# EAGLE design Elecrow SIMduino v2.2 (EAGLE 6.1)
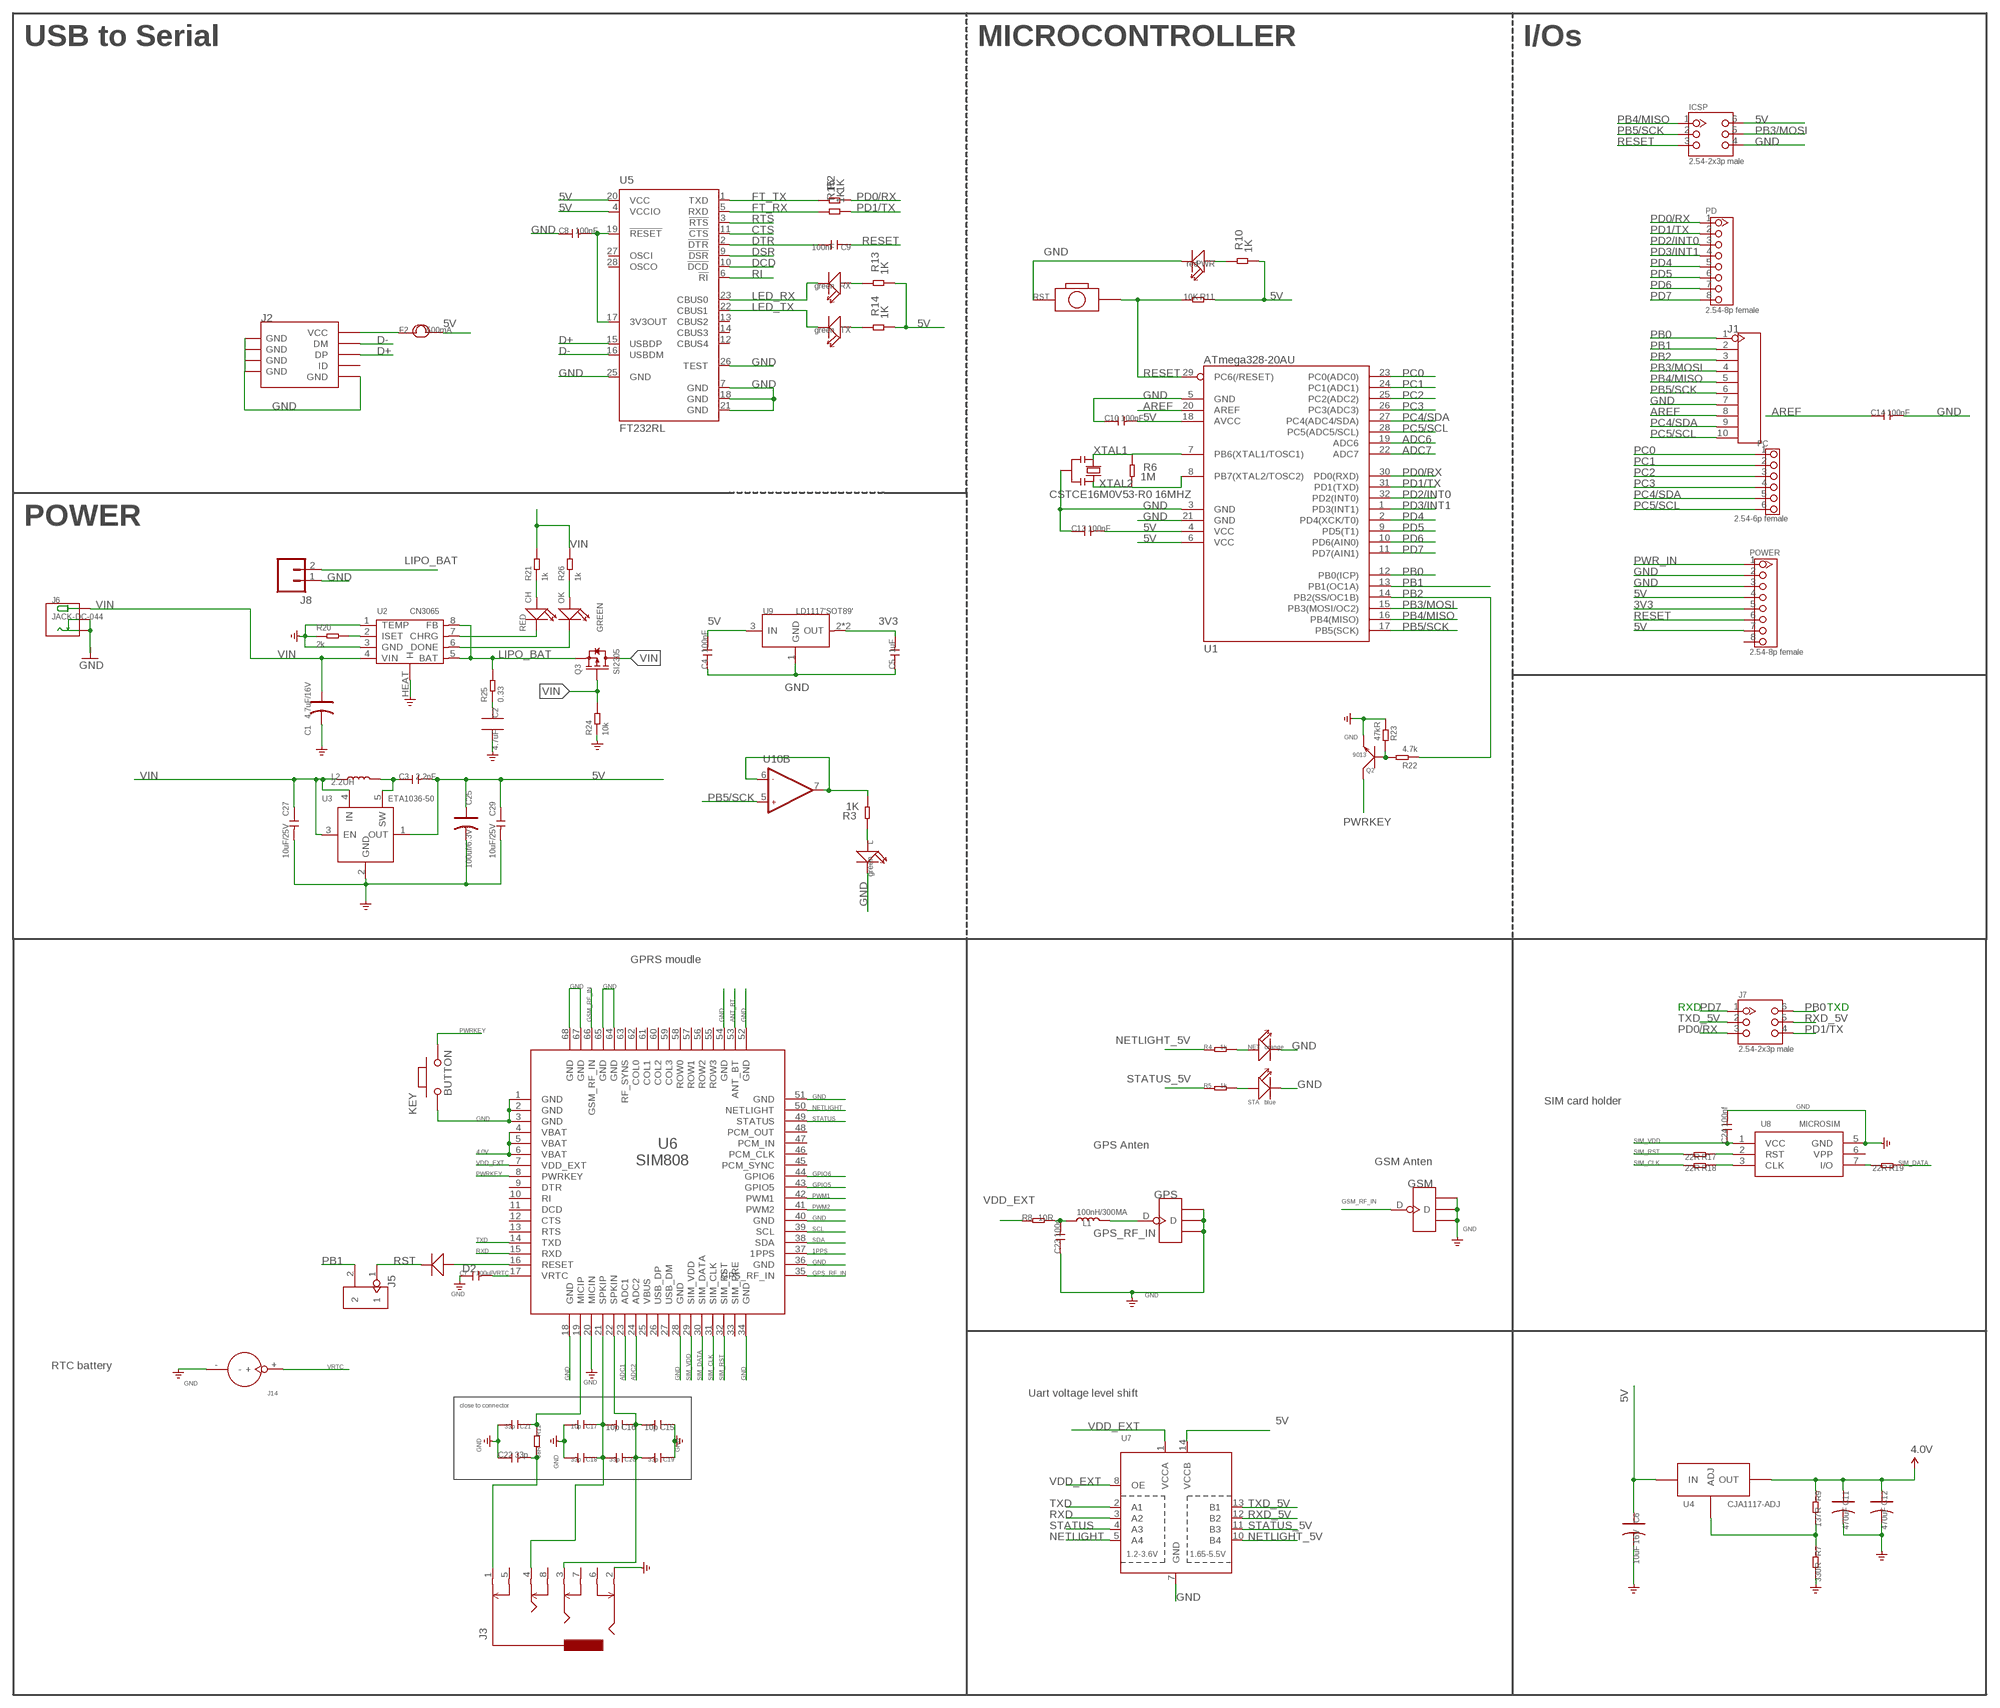
[diagram p0: schematic, sheet 1]

## Parts
C1  4.7uF/16V  006-CAP_AVX_A  [AVX_A]
C2  4.7uF  C0805  [0805]
C3  2.2nF  C-0603  [C0603]
C4  100nF  C-0603  [C0603]
C5  1uF  C-0603  [C0603]
C6  10uF 16V  CAP-AVX-A  [AVX-A]
C7  100uF  C-0805  [C0805]
C8  100nF  C-0603  [C0603]
C9  100nF  C-0603  [C0603]
C10  100nF  C-0603  [C0603]
C11  470uF  CAP-AVX-D  [AVX-D]
C12  470uF  CAP-AVX-D  [AVX-D]
C13  100nF  C-0603  [C0603]
C14  100nF  C-0603  [C0603]
C15  10p  C-0402  [C0402]
C16  10p  C-0402  [C0402]
C17  10p  C-0402  [C0402]
C18  33p  C-0402  [C0402]
C19  33p  C-0402  [C0402]
C20  33p  C-0402  [C0402]
C21  33p  C-0603  [C0603]
C22  33p  C-0603  [C0603]
C23  100n  C-0603  [C0603]
C24  100nf  C-0603  [C0603]
C25  100uf/6.3V  CAP-AVX-B  [AVX-B]
C27  10uF/25V  CAP-0805  [C0805]
C29  10uF/25V  CAP-0805  [C0805]
CH  RED  LED'0603'  [LED-0603]
D2  D'0805'  [SOD323]
F2  500mA  FUSE1206  [R1206@1]
GPS  ANTENNA-U-FL  [4P-U-FL]
GSM  ANTENNA-U-FL  [4P-U-FL]
ICSP  2.54-2x3p male  HEADER-2X3P-2.54  [2X3P-2.54]
J1  HEADER-10P-2.54  [10P-2.54]
J2  USB-MINIUSB-5P-STRONG  [MINI-SMD-5P]
J3  AUDIO-8P'PJ-3536-L6S'  [8P-3.5-SMD]
J5  HEADER-2P-65/35MIL  [2P-2.54-65/35MIL]
J6  JACK-DC-044  [DC-404]
J7  2.54-2x3p male  HEADER-2X3P-2.54  [2X3P-2.54]
J8  M02-JST-2MM-SMT  [JST-2-SMD]
J14  HOLDER-BATTERY-2P-CR1220  [CR1220]
KEY  BUTTON  PB157  [157SW]
L  green  LED'0603'  [LED-0603]
L1  100nH/300MA  L'0603'  [L0603]
L2  2.2UH  CD32'4R7'  [SD32-4R7MC]
NET  orange  LED'0603'  [LED-0603]
OK  GREEN  LED'0603'  [LED-0603]
PC  2.54-6p female  HEADER-6P-65/35MIL  [6P-2.54-65/35MIL]
PD  2.54-8p female  HEADER-8P-2.54  [8P-2.54]
POWER  2.54-8p female  HEADER-8P-2.54  [8P-2.54]
PWR  red  LED'0603'  [LED-0603]
Q2  9013  TRANSISTOR-NPN-SOT23  [SOT23]
Q3  SI2305  MOSFET-P'SI2323CDS/SI2305DS<BR>'  [SOT-23]
R2  1K  R-0603  [R0603]
R3  1K  R-0603  [R0603]
R4  1k  R-0603  [R0603]
R5  1k  R-0603  [R0603]
R6  1M  R-0603  [R0603]
R7  330R  R-0603  [R0603]
R8  10R  R-0603  [R0603]
R9  137R  R-0603  [R0603]
R10  1K  R-0603  [R0603]
R11  10K  R-0603  [R0603]
R12  68R  R-0603  [R0603]
R13  1K  R-0603  [R0603]
R14  1K  R-0603  [R0603]
R15  1K  R-0603  [R0603]
R17  22R  R-0603  [R0603]
R18  22R  R-0603  [R0603]
R19  22R  R-0603  [R0603]
R20  2k  RES-0603  [R0603]
R21  1k  RES-0603  [R0603]
R22  4.7k  R-0402  [R0402]
R23  47kR  R-0402  [R0402]
R24  10k  RES-0603  [R0603]
R25  0.33  RES-0603  [R0603]
R26  1k  RES-0603  [R0603]
RST  BOTTON-2P-90D  [2P-7.62X3.56-90D]
RX  green  LED'0603'  [LED-0603]
STA  blue  LED'0603'  [LED-0603]
TX  green  LED'0603'  [LED-0603]
U1  ATmega328-20AU  ATMEGA168  [TQFP32]
U2  CN3065  PMIC-CN3065-DFN8  [DFN-8]
U3  ETA1036-50  ETA1036  [SOT23-5]
U4  CJA1117-ADJ  [SOT89]
U5  FT232RL  [SSOP28]
U6  SIM808  [SIM808]
U7  TXB0104PWR  [TSSOP14]
U8  MICROSIM  [MICROSIM]
U9  LD1117'SOT89'  [SOT89]
U10  LMV358DGK  [MSOP8]
Y2  CSTCE16M0V53-R0 16MHZ  RESONATORMU  [RESONATOR]

## Nets
1PPS: U6.37(1PPS)
3V3: C5.2 POWER.5 U9.2(OUT) U9.4(OUT)
4.0V: C11.+ C12.+ R9.1 U4.2(OUT) U4.4(OUT) U6.4(VBAT) U6.5(VBAT) U6.6(VBAT)
5V [usbvcc]: C3.2 C4.2 C6.+ C10.2 C13.2 C25.+ C29.1 F2.2 ICSP.6 POWER.4 POWER.7 R10.1 R11.1 R13.1 R14.1 U1.4(VCC) U1.6(VCC) U1.18(AVCC) U3.1(OUT) U4.3(IN) U5.4(VCCIO) U5.20(VCC) U7.14(VCCB) U9.3(IN)
ADC1: U6.23(ADC1)
ADC2: U6.24(ADC2)
ADC6: U1.19(ADC6)
ADC7: U1.22(ADC7)
ANT_BT: U6.53(ANT_BT)
AREF: C14.1 J1.8 U1.20(AREF)
CTS: U5.11(!CTS)
D+: J2.3(DP) U5.15(USBDP)
D-: J2.2(DM) U5.16(USBDM)
DCD: U5.10(!DCD)
DSR: U5.9(!DSR)
DTR: C9.2 U5.2(!DTR)
FT_RX: R15.2 U5.5(RXD)
FT_TX: R2.2 U5.1(TXD)
GND: C1.- C2.2 C4.1 C5.1 C6.- C7.1 C8.1 C10.1 C11.- C12.- C13.1 C14.2 C15.1 C17.2 C18.2 C19.1 C21.2 C22.1 C23.1 C24.2 C25.- C27.2 C29.2 GPS.GND1 GPS.GND2 GPS.GND3 GSM.GND1 GSM.GND2 GSM.GND3 ICSP.4 J1.7 J2.5(GND) J2.GND@1(GND) J2.GND@2(GND) J2.GND@3(GND) J2.GND@4(GND) J3.2 J6.- J6.CDN J8.1 J14.- KEY.1 L.- NET.- POWER.2 POWER.3 PWR.- Q2.2(E) R7.2 R20.1 R23.1 R24.1 RST.P$1 STA.- U1.3(GND) U1.5(GND) U1.21(GND) U2.1(TEMP) U2.3(GND) U2.HEAT(H) U3.2(GND) U5.7(GND) U5.18(GND) U5.21(GND) U5.25(GND) U5.26(TEST) U6.1(GND) U6.2(GND) U6.3(GND) U6.18(GND) U6.20(MICIN) U6.28(GND) U6.34(GND) U6.36(GND) U6.40(GND) U6.51(GND) U6.52(GND) U6.54(GND) U6.64(GND) U6.65(GND) U6.67(GND) U6.68(GND) U7.7(GND) U8.5(GND) U9.1(GND) Y2.2
GPIO5: U6.43(GPIO5)
GPIO6: U6.44(GPIO6)
GPS_RF_IN: GPS.D L1.2 U6.35(GPS_RF_IN)
GSM_RF_IN: GSM.D U6.66(GSM_RF_IN)
LED_RX: RX.- U5.23(CBUS0)
LED_TX: TX.- U5.22(CBUS1)
LIPO_BAT: J8.2 Q3.2(S) R25.2 U2.5(BAT) U2.8(FB)
N$1: R20.2 U2.2(ISET)
N$2: R13.2 RX.+
N$3: L.+ R3.2
N$4: R5.2 STA.+
N$5: R3.1 U10.6(B:-IN2) U10.7(B:OUT2)
N$6: C8.2 U5.17(3V3OUT) U5.19(!RESET)
N$7: PWR.+ R10.2
N$8: R14.2 TX.+
N$9: F2.1 J2.1(VCC)
N$10: NET.+ R4.2
N$11: R18.1 U8.3(CLK)
N$12: R17.1 U8.2(RST)
N$13: C21.1 R12.1 U6.19(MICIP)
N$15: C16.2 C17.1 C18.1 C20.2 J3.4 U6.21(SPKIP)
N$16: R19.2 U8.7(I/O)
N$17: R7.1 R9.2 U4.1(ADJ)
N$18: D2.+ U6.16(RESET)
N$19: C15.2 C16.1 C19.2 C20.1 J3.3 U6.22(SPKIN)
N$20: CH.- U2.7(CHRG)
N$21: C23.2 L1.1 R8.2
N$22: OK.- U2.6(DONE)
N$23: OK.+ R26.1
N$24: C2.1 R25.1
N$25: CH.+ R21.1
N$27: C3.1 L2.2 U3.5(SW)
N$30: C22.2 J3.1 R12.2
N$68: Q2.1(B) R22.2 R23.2
NETLIGHT: U6.50(NETLIGHT) U7.5(A4)
NETLIGHT_5V: R4.1 U7.10(B4)
PB0: J1.1 J7.6 U1.12(PB0(ICP))
PB1: J1.2 J5.2 U1.13(PB1(OC1A))
PB2: J1.3 R22.1 U1.14(PB2(SS/OC1B))
PB3/MOSI: ICSP.5 J1.4 U1.15(PB3(MOSI/OC2))
PB4/MISO: ICSP.1 J1.5 U1.16(PB4(MISO))
PB5/SCK: ICSP.2 J1.6 U1.17(PB5(SCK)) U10.5(B:+IN2)
PC0: PC.1 U1.23(PC0(ADC0))
PC1: PC.2 U1.24(PC1(ADC1))
PC2: PC.3 U1.25(PC2(ADC2))
PC3: PC.4 U1.26(PC3(ADC3))
PC4/SDA: J1.9 PC.5 U1.27(PC4(ADC4/SDA))
PC5/SCL: J1.10 PC.6 U1.28(PC5(ADC5/SCL))
PD0/RX: J7.3 PD.1 R2.1 U1.30(PD0(RXD))
PD1/TX: J7.4 PD.2 R15.1 U1.31(PD1(TXD))
PD2/INT0: PD.3 U1.32(PD2(INT0))
PD3/INT1: PD.4 U1.1(PD3(INT1))
PD4: PD.5 U1.2(PD4(XCK/T0))
PD5: PD.6 U1.9(PD5(T1))
PD6: PD.7 U1.10(PD6(AIN0))
PD7: J7.1 PD.8 U1.11(PD7(AIN1))
PWM1: U6.42(PWM1)
PWM2: U6.41(PWM2)
PWR_IN: POWER.1
PWRKEY: KEY.2 Q2.3(C) U6.8(PWRKEY)
RESET: C9.1 ICSP.3 POWER.6 R11.2 RST.P$2 U1.29(PC6(/RESET))
RI: U5.6(!RI)
RST: D2.- J5.1
RTS: U5.3(!RTS)
RXD: U6.15(RXD) U7.3(A2)
RXD_5V: J7.5 U7.12(B2)
SCL: U6.39(SCL)
SDA: U6.38(SDA)
SIM_CLK: R18.2 U6.31(SIM_CLK)
SIM_DATA: R19.1 U6.30(SIM_DATA)
SIM_RST: R17.2 U6.32(SIM_RST)
SIM_VDD: C24.1 U6.29(SIM_VDD) U8.1(VCC)
STATUS: U6.49(STATUS) U7.4(A3)
STATUS_5V: R5.1 U7.11(B3)
TXD: U6.14(TXD) U7.2(A1)
TXD_5V: J7.2 U7.13(B1)
VDD_EXT: R8.1 U6.7(VDD_EXT) U7.1(VCCA) U7.8(OE)
VIN: C1.+ C27.1 J6.+ L2.1 Q3.1(G) Q3.3(D) R21.2 R24.2 R26.2 U2.4(VIN) U3.3(EN) U3.4(IN)
VRTC: C7.2 J14.+ U6.17(VRTC)
XTAL1: R6.2 U1.7(PB6(XTAL1/TOSC1)) Y2.1
XTAL2: R6.1 U1.8(PB7(XTAL2/TOSC2)) Y2.3
Unconnected: J2.4(ID) J3.5 J3.6 J3.7 J3.8 POWER.8 U5.12(CBUS4) U5.13(CBUS2) U5.14(CBUS3) U5.27(OSCI) U5.28(OSCO) U6.9(DTR) U6.10(RI) U6.11(DCD) U6.12(CTS) U6.13(RTS) U6.25(VBUS) U6.26(USB_DP) U6.27(USB_DM) U6.33(SIM_PRE) U6.45(PCM_SYNC) U6.46(PCM_CLK) U6.47(PCM_IN) U6.48(PCM_OUT) U8.6(VPP) U10.1(A:OUT1) U10.2(A:-IN1) U10.3(A:+IN1)

## Notes on the sheet
- USB to Serial | MICROCONTROLLER | I/Os
- POWER
- GPRS moudle
- RXD | TXD
- SIM card holder
- GPS Anten
- GSM Anten
- RTC battery
- Uart voltage level shift
- close to connector

## Power pins joined to a net without a drawn wire
+V: U10.8(A:+V)
COL0: U6.62(COL0)
COL1: U6.61(COL1)
COL2: U6.60(COL2)
COL3: U6.59(COL3)
GND: U10.4(A:GND)
RF_SYNS: U6.63(RF_SYNS)
ROW0: U6.58(ROW0)
ROW1: U6.57(ROW1)
ROW2: U6.56(ROW2)
ROW3: U6.55(ROW3)

## Library data of the parts
C1 = Discrete:006-CAP*: Electrolytic Capacitors,Tantalum Capacitors and Super Capacitors
C2 = CPT_SMD:C0805
C3-C5 C7-C10 C13-C24 = Discrete:C*: Ceramic Capacitors
C6 C11 C12 = Common:CAP*
C25 = Discrete:CAP*: Electrolytic Capacitors,Tantalum Capacitors and Super Capacitors
C27 C29 = Discrete-new:CAP: Ceramic Capacitors
CH OK = Discrete-new:LED
D2 = Discrete:D*
F2 = Discrete:FUSE
GPS GSM = Connector:ANTENNA-U-FL
ICSP J7 = Connector:HEADER-2X3P
J1 = Connector:HEADER-10P
J2 = Connector:USB-MINIUSB-5P
J3 = template:AUDIO-8P
J5 = Connector:HEADER-2P
J6 = Connector:JACK-DC-044
J8 = SparkFun:M02: Header 2 Standard 2-pin 0.1" header. Use with straight break away headers (SKU : PRT-00116), right angle break away headers (PRT-00553), swiss pins (PRT-00743), machine pins (PRT-00117), and female headers (PRT-00115). Molex polarized connector foot print use with SKU : PRT-08233 with associated crimp pins and housings.
J14 = Connector:HOLDER-BATTERY-2P
KEY = MySMD:PB157
L NET PWR RX STA TX = Discrete:LED*
L1 = Discrete:L*
L2 = template:CD32: ferrite cored coil
PC = Connector:HEADER-6P
PD POWER = Connector:HEADER-8P
Q2 = Discrete:TRANSISTOR-NPN*: NPN audion
Q3 = Discrete-new:MOSFET-P
R2-R15 R17-R19 R22 R23 = Discrete:R*
R20 R21 R24-R26 = Discrete-new:RES
RST = Discrete:BOTTON-2P
U1 = IC:ATMEGA168
U2 = IC-new:PMIC-CN3065: 310030101
U3 = IC:ETA1036
U4 = IC:CJA1117-ADJ
U5 = IC_SMD:FT232R: Source: http://www.ftdichip.com/Documents/DataSheets/DS_FT232R_v104.pdf
U6 = moudle:SIM808
U7 = adafruit:TXB0104PWR: 4-Bit Bi-Directional Level Shifter 1.2V-3.6V (VCCA) to 1.65V-5.5V (VCCB) bi-directional level shifter with auto direction sensing. Max data rate - VCCA 1.8V: 20Mbps (50ns), VCCA 3.3V: 100Mbps (10ns) Digikey: 296-21929-1-ND
U8 = Connector:MICROSIM
U9 = IC:LD1117: Low Drop Fixed And Adjustable Positive Voltage Regulators http://www.datasheetcatalog.org/datasheet/SGSThomsonMicroelectronics/mXuqtqv.pdf
U10 = IC:LMV358: General purpose LOW Voltage, Rail-to-Rail Output Amplifiers http://www.fairchildsemi.com/ds/LM/LMV358.pdf
Y2 = SmartPrj:RESONATOR

## Net classes
0 default: width 0.152 mm, drill 0.152 mm, clearance 0.152 mm
1 power: width 0.61 mm, drill 0.61 mm, clearance 0.254 mm
2 gnd: width 0.305 mm, drill 0.559 mm, clearance 0.254 mm
3 usbvcc: width 0.508 mm, drill 0.61 mm, clearance 0.254 mm

## Board
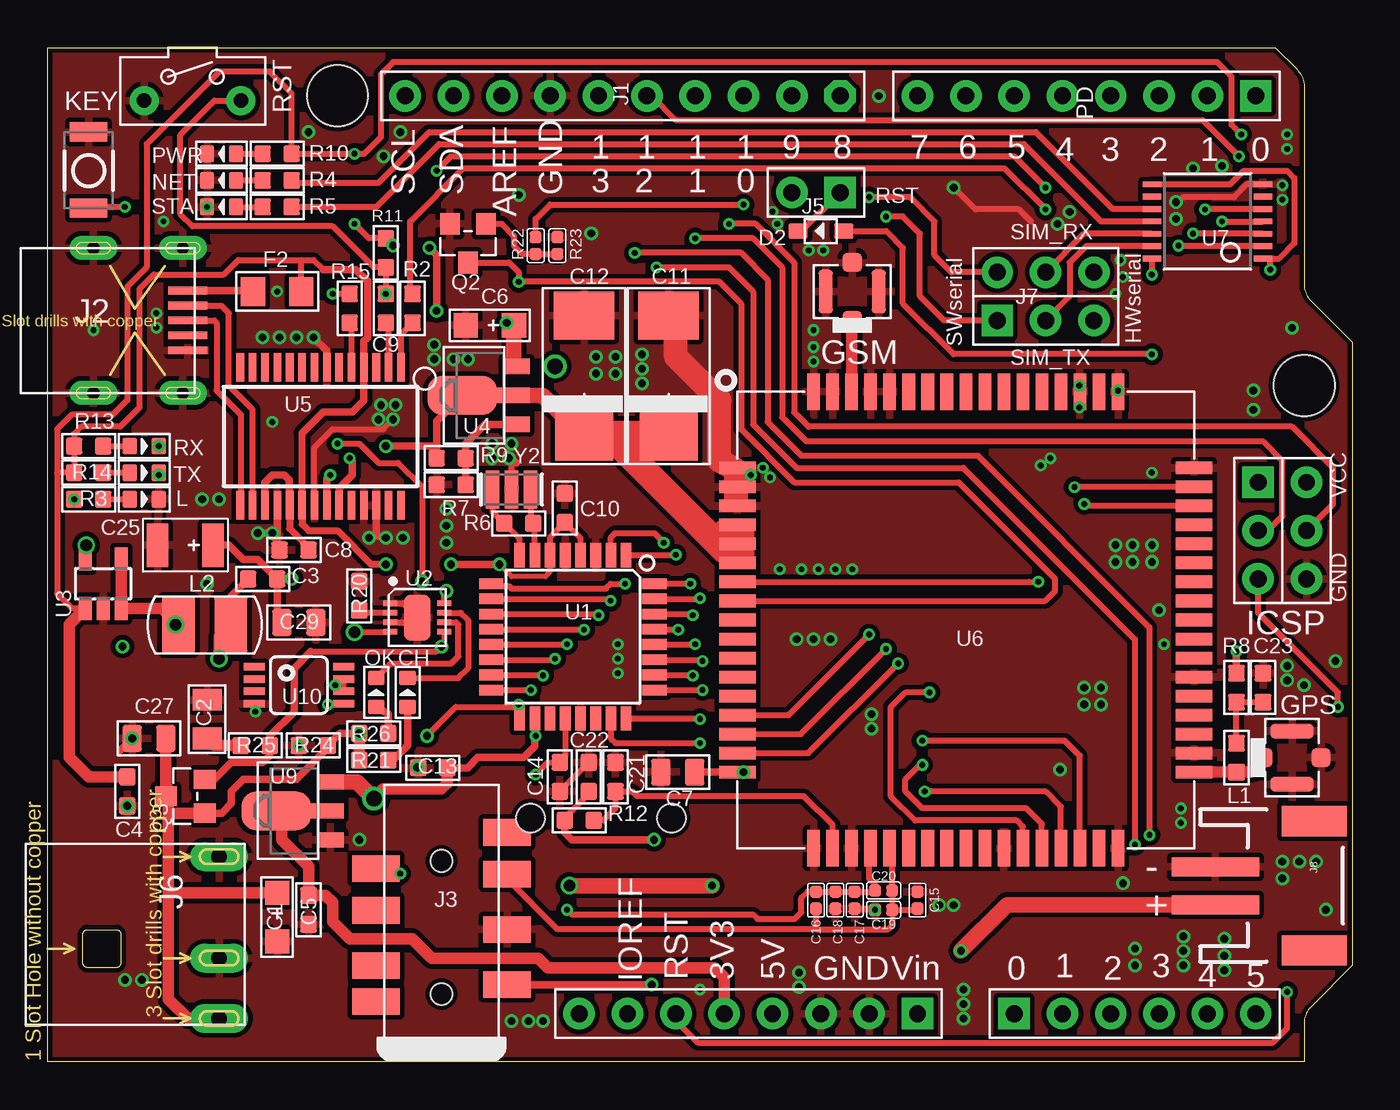
[diagram p1: board, top side]
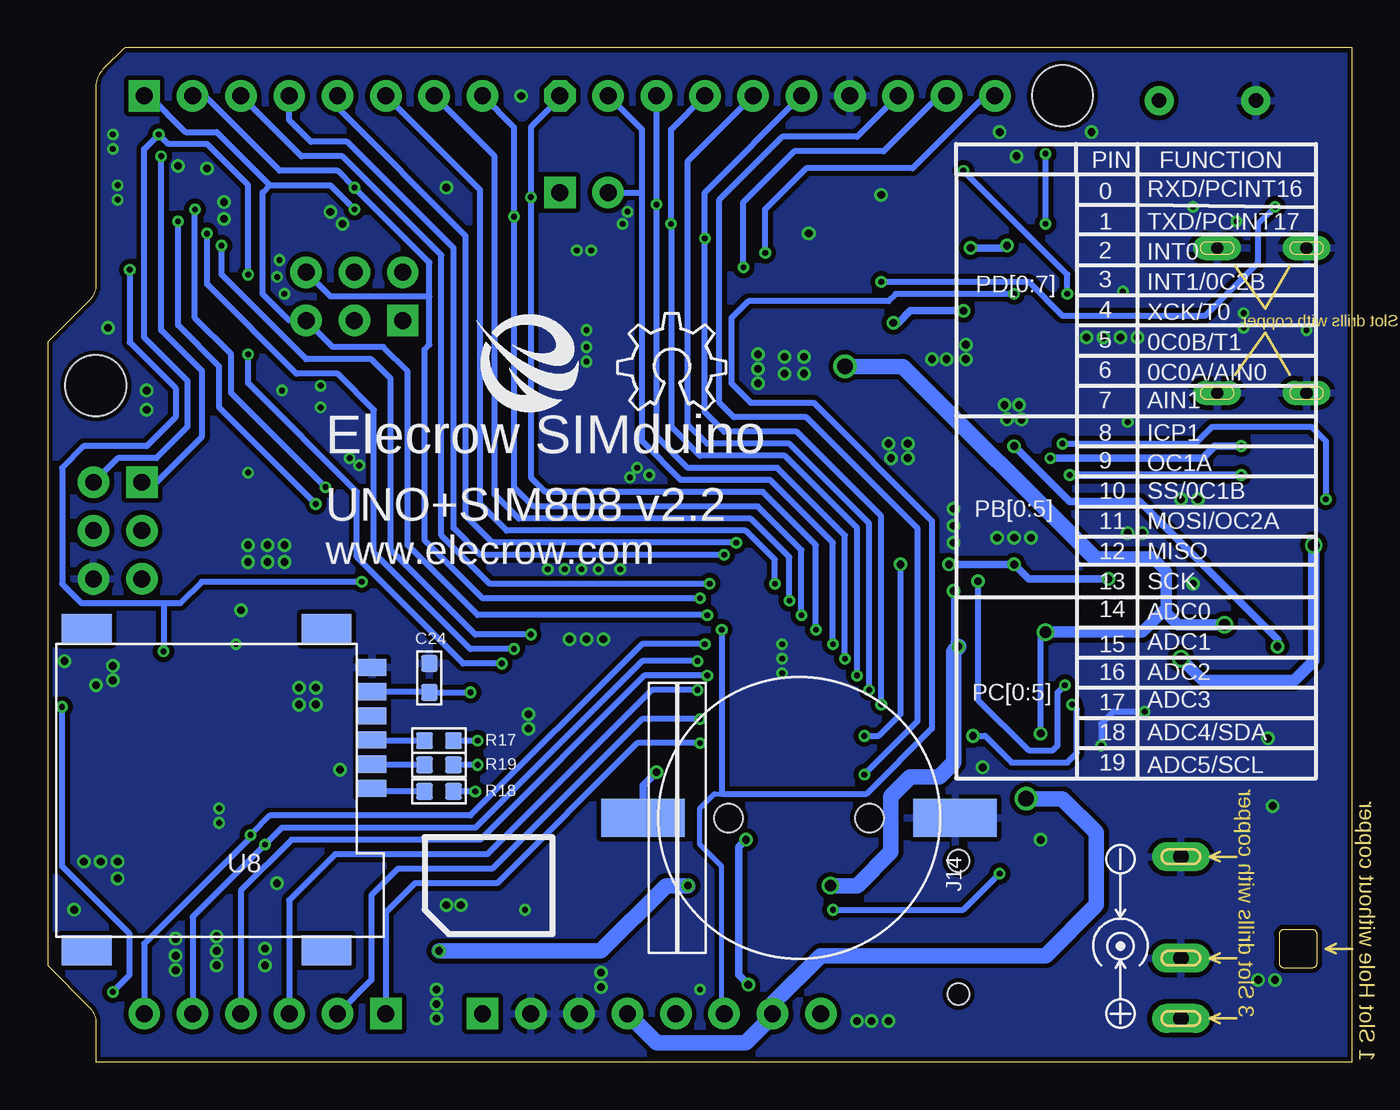
[diagram p2: board, bottom side, seen from below]

Size 68.58 x 53.34 mm. Coordinates in mm from the lower left corner, seen from the top.
Outline: 0,0 0,53.34 64.52,53.34 65.67,52.19 arc-45 66.04,51.29 66.04,40.91 arc45 66.41,40.01 68.58,37.85 68.58,5.08 66.41,2.91 arc45 66.04,2.01 66.04,0 0,0
Copper layers (1*16): Top 0.035mm / dielectric 1.5mm / Bottom 0.035mm
Design rules: minimum track width 6mil, minimum drill 8mil, track to track 6mil, track to pad 6mil, pad to pad 6mil, via to via 6mil, smd to smd 0mil, copper to edge 10mil, drill to drill 10mil, minimum pad ring 10mil, minimum via ring 6mil, stop-mask expansion 2mil, vias tented up to drill 100mil, thermal gap 10mil
Holes 3.2 mm at 15.24,50.8 66.04,35.56
tRestrict: area 21.7,32.4 to 21.8,34; area 44.2,24.4 to 44.6,24.6

### Footprints (pad centres in the part's own frame; a part is rotated, then mirrored left to right if it is on the bottom)
AVX_A = smd 1.27 x 1.27: + -1.27,0; - 1.27,0
0805 = smd 1.143 x 1.524: 1 -1.016,0; 2 1.016,0
C0603 = smd 0.889 x 0.889: 1 -0.762,0; 2 0.762,0
AVX-A = smd 1.27 x 1.27: + -1.27,0; - 1.27,0
C0805 = smd 1.016 x 1.397: 1 -0.889,0; 2 0.889,0
AVX-D = smd 2.54 x 3.048: + -3.175,0 | smd 2.54 x 3.175: - 3.175,0
C0402 = smd 0.635 x 0.635: 1 -0.445,0; 2 0.445,0
AVX-B = smd 1.143 x 2.286: + -1.46,0; - 1.46,0
LED-0603 = smd 0.762 x 0.889: + -0.762,0; - 0.762,0
SOD323 = smd 1 x 0.8: + -1.2,0; - 1.2,0
R1206@1 = smd 1.27 x 1.524: 1 -1.27,0; 2 1.27,0
4P-U-FL = smd 1.016 x 1.016: D -1.524,0; GND3 1.524,0 | smd 2.286 x 0.762: GND1 0,1.397; GND2 0,-1.397
2X3P-2.54 = drill 0.889 pad 1.651 square: 1 -1.27,2.54 | drill 0.889 pad 1.651: 2 -1.27,0; 3 -1.27,-2.54; 4 1.27,-2.54; 5 1.27,0; 6 1.27,2.54
10P-2.54 = drill 0.889 pad 1.651 octagon: 1 0,11.43 | drill 0.889 pad 1.651: 2 0,8.89; 3 0,6.35; 4 0,3.81; 5 0,1.27; 6 0,-1.27; 7 0,-3.81; 8 0,-6.35; 9 0,-8.89; 10 0,-11.43
MINI-SMD-5P = smd 2.032 x 0.406: 1 0.381,-1.575; 2 0.381,-0.787; 3 0.381,0; 4 0.381,0.787; 5 0.381,1.575 | drill 0.635 pad 1.27 long: GND@1 0.635,3.81; GND@2 5.334,3.81; GND@3 5.334,-3.81; GND@4 0.635,-3.81
8P-3.5-SMD = smd 1.4 x 2.5: 1 2.8,-3.45; 2 5.7,-3.45; 3 8.6,-3.45; 4 8.9,3.45; 5 1.9,3.45; 6 3.8,3.45; 7 6.7,3.45; 8 10.8,-3.45 | hole 1.149: 2.3,0; 9.3,0
2P-2.54-65/35MIL = drill 0.889 pad 1.651 square: 1 0,1.27 | drill 0.889 pad 1.651: 2 0,-1.27
DC-404 = drill 0.813 pad 1.524 long: + 3.175,10.16; - -5.334,10.16; CDN 0,10.16
JST-2-SMD = smd 1 x 4.6: 1 -1,-3.7; 2 1,-3.7 | smd 1.6 x 3.4: NC1 -3.4,1.5; NC2 3.4,1.5
CR1220 = smd 2 x 4.4: + 0,-8.2; - 0,8.2 | hole 1.5: 0,3.7; 0,-3.7
157SW = smd 1.016 x 1.981: 1 0,0; 2 4,0
L0603 = smd 0.889 x 0.889: 1 -0.762,0; 2 0.762,0
SD32-4R7MC = smd 1.75 x 3: 1 -1.375,0; 2 1.375,0
6P-2.54-65/35MIL = drill 0.889 pad 1.651 square: 1 0,6.35 | drill 0.889 pad 1.651: 2 0,3.81; 3 0,1.27; 4 0,-1.27; 5 0,-3.81; 6 0,-6.35
8P-2.54 = drill 0.889 pad 1.651 square: 1 0,8.89 | drill 0.889 pad 1.651: 2 0,6.35; 3 0,3.81; 4 0,1.27; 5 0,-1.27; 6 0,-3.81; 7 0,-6.35; 8 0,-8.89
SOT23 = smd 1.016 x 1.143: 1 -0.95,-1.016; 2 0.95,-1.016; 3 0,1.016
SOT-23 = smd 1.016 x 1.143: 1 -0.889,-1.016; 2 0.889,-1.016; 3 0,1.016
R0603 = smd 0.889 x 0.889: 1 -0.762,0; 2 0.762,0
R0402 = smd 0.635 x 0.635: 1 -0.445,0; 2 0.445,0
2P-7.62X3.56-90D = drill 0.762 pad 1.524: P$1 0,2.54; P$2 0,-2.54
TQFP32 = smd 1.27 x 0.559: 1 -4.293,2.8; 2 -4.293,2; 3 -4.293,1.2; 4 -4.293,0.4; 5 -4.293,-0.4; 6 -4.293,-1.2; 7 -4.293,-2; 8 -4.293,-2.8; 17 4.293,-2.8; 18 4.293,-2; 19 4.293,-1.2; 20 4.293,-0.4; 21 4.293,0.4; 22 4.293,1.2; 23 4.293,2; 24 4.293,2.8 | smd 0.559 x 1.27: 9 -2.8,-4.293; 10 -2,-4.293; 11 -1.2,-4.293; 12 -0.4,-4.293; 13 0.4,-4.293; 14 1.2,-4.293; 15 2,-4.293; 16 2.8,-4.293; 25 2.8,4.293; 26 2,4.293; 27 1.2,4.293; 28 0.4,4.293; 29 -0.4,4.293; 30 -1.2,4.293; 31 -2,4.293; 32 -2.8,4.293
DFN-8 = smd 0.3 x 0.727: 1 -0.75,-1.413; 2 -0.25,-1.413; 3 0.25,-1.413; 4 0.75,-1.413; 5 0.75,1.413; 6 0.25,1.413; 7 -0.25,1.413; 8 -0.75,1.413 | smd 2.413 x 1.397: HEAT 0,0
SOT23-5 = smd 0.69 x 1.2: 1 -0.95,-1.3; 2 0,-1.3; 3 0.95,-1.3; 4 0.95,1.3; 5 -0.95,1.3
SOT89 = smd 0.8 x 1.4: 1 -1.524,-1.905; 3 1.524,-1.905 | smd 0.8 x 1.9: 2 0,-1.651 | smd 2.032 x 3.65: 4 0,0.94
SSOP28 = smd 0.4 x 1.5: 1 -4.225,-3.625; 2 -3.575,-3.625; 3 -2.925,-3.625; 4 -2.275,-3.625; 5 -1.625,-3.625; 6 -0.975,-3.625; 7 -0.325,-3.625; 8 0.325,-3.625; 9 0.975,-3.625; 10 1.625,-3.625; 11 2.275,-3.625; 12 2.925,-3.625; 13 3.575,-3.625; 14 4.225,-3.625; 15 4.225,3.625; 16 3.575,3.625; 17 2.925,3.625; 18 2.275,3.625; 19 1.625,3.625; 20 0.975,3.625; 21 0.325,3.625; 22 -0.325,3.625; 23 -0.975,3.625; 24 -1.625,3.625; 25 -2.275,3.625; 26 -2.925,3.625; 27 -3.575,3.625; 28 -4.225,3.625
SIM808 = smd 1.93 x 0.66: 1 -10.349,7.238; 2 -10.349,6.238; 3 -10.349,5.238; 4 -10.349,4.238; 5 -10.349,3.238; 6 -10.349,2.238; 7 -10.349,1.238; 8 -10.349,0.238; 9 -10.349,-0.762; 10 -10.349,-1.762; 11 -10.349,-2.762; 12 -10.349,-3.762; 13 -10.349,-4.762; 14 -10.349,-5.762; 15 -10.349,-6.762; 16 -10.349,-7.762; 17 -10.349,-8.762; 35 13.651,-8.762; 36 13.651,-7.762; 37 13.651,-6.762; 38 13.651,-5.762; 39 13.651,-4.762; 40 13.651,-3.762; 41 13.651,-2.762; 42 13.651,-1.762; 43 13.651,-0.762; 44 13.651,0.238; 45 13.651,1.238; 46 13.651,2.238; 47 13.651,3.238; 48 13.651,4.238; 49 13.651,5.238; 50 13.651,6.238; 51 13.651,7.238 | smd 0.66 x 1.93: 18 -6.349,-12.762; 19 -5.349,-12.762; 20 -4.349,-12.762; 21 -3.349,-12.762; 22 -2.349,-12.762; 23 -1.349,-12.762; 24 -0.349,-12.762; 25 0.651,-12.762; 26 1.651,-12.762; 27 2.651,-12.762; 28 3.651,-12.762; 29 4.651,-12.762; 30 5.651,-12.762; 31 6.651,-12.762; 32 7.651,-12.762; 33 8.651,-12.762; 34 9.651,-12.762; 52 9.651,11.238; 53 8.651,11.238; 54 7.651,11.238; 55 6.651,11.238; 56 5.651,11.238; 57 4.651,11.238; 58 3.651,11.238; 59 2.651,11.238; 60 1.651,11.238; 61 0.651,11.238; 62 -0.349,11.238; 63 -1.349,11.238; 64 -2.349,11.238; 65 -3.349,11.238; 66 -4.349,11.238; 67 -5.349,11.238; 68 -6.349,11.238
TSSOP14 = smd 0.305 x 0.991: 1 -1.95,-2.918; 2 -1.3,-2.918; 3 -0.65,-2.918; 4 0,-2.918; 5 0.65,-2.918; 6 1.3,-2.918; 7 1.95,-2.918; 8 1.95,2.918; 9 1.3,2.918; 10 0.65,2.918; 11 0,2.918; 12 -0.65,2.918; 13 -1.3,2.918; 14 -1.95,2.918
MICROSIM = smd 1.5 x 0.9: 1 -0.8,2.5; 2 -0.8,5.04; 3 -0.8,7.58; 5 -0.8,1.23; 6 -0.8,3.77; 7 -0.8,6.31 | smd 2.61 x 1.56: P$1 1.6,-0.8; P$2 14.2,-0.8; P$3 14.2,16.1; P$4 1.6,16.1
MSOP8 = smd 0.4 x 1.1: 1 -0.975,-2.35; 2 -0.325,-2.35; 3 0.325,-2.35; 4 0.975,-2.35; 5 0.975,2.35; 6 0.325,2.35; 7 -0.325,2.35; 8 -0.975,2.35
RESONATOR = smd 0.7 x 2: 1 -1,0; 2 0,0; 3 1,0

### Placement (x,y rotation side)
C1  12.06,7.62 270 top
C2  8.38,18.03 90 top
C3  11.3,25.4 0 top
C4  4.19,14.22 90 top
C5  13.72,8 90 top
C6  23.24,38.73 180 top
C7  33.12,15.24 0 top
C8  12.95,26.92 0 top
C9  17.78,39.62 270 top
C10  27.18,29.13 270 top
C11  32.64,36.07 90 top
C12  28.19,36.07 90 top
C13  20.24,15.47 0 top
C14  26.92,14.99 270 top
C15  45.72,8.51 270 top
C16  40.39,8.51 90 top
C17  42.42,8.51 270 top
C18  41.4,8.51 270 top
C19  43.94,8 0 top
C20  43.94,9.02 180 top
C21  29.84,14.99 90 top
C22  28.45,14.99 270 top
C23  63.88,19.68 270 top
C24  48.51,20.19 90 bottom
C25  7.24,27.18 180 top
C27  5.33,17.02 180 top
C29  13.21,23.11 0 top
CH  18.92,19.43 90 top
D2  40.64,43.69 180 top
F2  12.06,40.51 0 top
GPS  65.41,16 0 top
GSM  42.29,40.51 90 top
ICSP  64.9,27.94 0 top
J1  30.23,50.8 270 top
J2  7.75,38.99 180 top
J3  20.7,1.27 90 top
J5  40.39,45.72 270 top
J6  -1.14,5.46 270 top
J7  52.45,40.26 90 top
J8  65.07,9.27 270 top
J14  29.08,12.83 270 bottom
KEY  2.16,48.9 270 top
L  5.08,29.59 0 top
L1  62.48,16 270 top
L2  8.26,22.99 0 top
NET  9.14,46.35 180 top
OK  17.27,19.43 90 top
PC  57.15,2.54 90 top
PD  54.61,50.8 270 top
POWER  36.83,2.54 270 top
PWR  9.14,47.75 180 top
Q2  22.1,43.05 180 top
Q3  7.24,13.97 90 top
R2  19.18,39.62 270 top
R3  2.16,29.59 0 top
R4  12.06,46.35 180 top
R5  12.06,44.96 180 top
R6  24.77,28.32 0 top
R7  21.21,30.35 180 top
R8  62.48,19.68 270 top
R9  21.21,31.75 0 top
R10  12.06,47.75 180 top
R11  17.78,42.55 270 top
R12  27.94,12.7 180 top
R13  2.16,32.38 0 top
R14  2.16,30.99 0 top
R15  15.88,39.62 270 top
R17  48.01,16.89 0 bottom
R18  48.01,14.22 0 bottom
R19  48.01,15.62 180 bottom
R20  16.38,24.51 270 top
R21  17.14,15.88 180 top
R22  25.65,42.93 270 top
R23  26.8,42.93 270 top
R24  13.97,16.64 0 top
R25  10.92,16.64 0 top
R26  17.14,17.27 180 top
RST  7.62,50.55 90 top
RX  5.08,32.38 0 top
STA  9.14,44.96 180 top
TX  5.08,30.99 0 top
U1  27.61,22.35 270 top
U2  19.43,23.37 270 top
U3  2.92,25.15 0 top
U4  22.73,35.05 90 top
U5  14.35,32.89 180 top
U6  46.61,24 0 top
U7  60.96,44.2 90 top
U8  52.32,21.97 180 bottom
U9  12.95,13.21 90 top
U10  13.21,19.81 270 top
U$1  [OSHW_6X200_NOTEXT]  38.61,34.29 0 bottom
U$2  [ELECROW-NEW]  46.1,34.16 0 bottom
Y2  24.38,30.1 180 top

### Tracks (layer width: path | path; a pad name or v marks a point on that pad's centre or on a via)
3V3
  Top 0.61: POWER.5 35.56,4.45 35.05,4.95 26.29,4.95 25.78,5.46 20.19,5.46 19.18,6.48 15.88,6.48 14.99,7.37 14.99,8.38 14.61,8.76 C5.2 13.72,10.29 12.32,11.68 12.32,12.9 U9.4 U9.2
4.0V  (via drill 0.41)
  Top 0.305: U4.4 U4.2
  Top 0.406: U6.6 U6.5 36.26,26.61 36.7,26.16 36.96,26.16 36.96,26.67 | R9.1 20.45,32.51 | 20.45,32.51 20.45,33.71 U4.4 | U6.4 36.4,28.24 36.7,27.94 | 36.7,27.94 36.96,27.69 | 36.96,27.69 36.96,27.94 36.7,27.94 | 36.96,27.69 36.96,26.67 | 36.96,26.67 36.45,26.67 36.45,27.94 36.32,27.94 36.32,27.69 | 36.32,27.69 36.7,27.69 36.7,26.92 | 36.32,27.69 35.56,27.69 | v17.78,32.38 20.32,32.38 20.45,32.51
  Top 0.813: 27.18,32.77 28.07,32.77 C12.+ 26.04,35.05 U4.2
  Top 1.422: C12.+ 29.59,32.89 35.56,26.92 35.56,27.69 35.56,27.81
  Top 1.676: C12.+ C11.+
  Bottom 0.406: v3.94,21.84 3.94,22.23 11.18,29.46 14.86,29.46 v17.78,32.38
5V  (via drill 0.3, 0.41, 0.81)
  Top 0.254: U1.6 26.42,25.78 26.16,25.53 24.38,25.53 v23.75,26.16
  Top 0.305: R11.1 16.89,43.31 v16.13,44.07 | U7.14 v58.04,41.41 v58.04,41.4 | U1.6 26.41,27.6 C10.2 28.01,27.54 U1.4 | v62.74,48.77 62.23,49.28 62.23,51.82 61.47,52.58 18.16,52.58 17.53,51.94 17.53,48.64 16.64,47.75 v16.13,47.75 R10.1 12.83,50.93 11.68,52.07 9.02,52.07 5.21,48.26 5.21,41.78 4.19,40.77 4.19,34.8 3.43,34.04 1.27,34.04 0.51,33.27 0.51,30.99 | 13.34,42.16 10.03,42.16 9.27,41.4 5.59,41.4 4.83,40.64 4.83,34.42 3.81,33.4 1.78,33.4 1.4,33.02 R13.1 R14.1 0.51,30.99 | 13.34,42.16 13.97,42.16 14.48,41.66 | F2.2 13.34,42.16 | 0.51,30.99 0.51,24.64 1.3,23.85 U3.1 | U1.18 25.61,17.19 v25.65,17.14
  Top 0.356: 13.38,33.06 U5.20 13.38,28.28 13.72,27.94 15.24,27.94 17.02,26.16 v17.78,26.16
  Top 0.406: v23.75,26.16 v21.21,26.16 | U1.18 25.61,16.59 25.02,16 22.61,16 22.07,15.47 C13.2 | 14.48,41.66 16.2,41.66 16.82,41.05 16.82,38.1 16.63,37.91 U5.4 16.63,34.79 16,34.16 14.48,34.16 13.38,33.06 | C3.2 12.06,23.37 C29.1 | C3.2 v12.83,25.4 | C25.+ 9.53,27.18 10.29,26.42 11.05,26.42 C3.2 | C6.+ 24.26,38.73 v24.13,38.86 | v20.45,39.5 20.45,42.42 v20.07,42.8 | v18.16,42.93 R11.1
  Top 0.61: C13.2 21.01,14.66 20.7,14.35 17.65,14.35 v17.14,13.84 | C4.2 2.16,14.99 1.14,16 1.14,23.02 U3.1
  Top 0.813: U9.3 16.26,14.73 v17.14,13.84 | C6.+ 24.51,36.7 U4.3
  Bottom 0.305: v16.13,44.07 v16.13,47.75 | v58.04,41.4 58.04,46.1 60.2,48.26 62.23,48.26 v62.74,48.77 63.5,48.01 63.5,38.1 61.21,35.81 61.21,33.4 62.87,31.75 64.9,31.75 ICSP.6 | v25.65,17.14 24.89,17.14 23.75,18.29 v23.75,26.16
  Bottom 0.406: v21.21,26.16 v17.78,26.16 17.02,25.4 v12.83,25.4 | v24.13,38.86 23.88,38.86 23.24,39.5 v20.45,39.5 | v20.07,42.8 18.29,42.8 v18.16,42.93
  Bottom 0.61: POWER.7 30.48,2.41
  Bottom 0.813: 30.48,2.41 31.88,1.02 36.58,1.02 POWER.4 | POWER.7 30.48,3.05 27.94,5.59 16.13,5.59 13.46,8.26 13.46,12.06 15.24,13.84 v17.14,13.84
AREF  (via drill 0.3)
  Top 0.305: U1.20 27.21,16.09 C14.1 26.29,15.75 v25.65,15.11
  Bottom 0.305: J1.8 26.04,48.64 29.97,48.64 33.27,45.34 33.27,34.67 32.51,33.91 28.7,33.91 22.86,28.07 22.86,17.91 v25.65,15.11
D+
  Top 0.305: J2.3 8.76,38.99 8.89,38.86 8.89,35.31 10.16,34.04 10.16,29.3 U5.15
D-
  Top 0.305: U5.16 10.78,34.31 9.53,35.56 9.53,39.37 9.14,39.75 7.39,39.75 J2.2
DTR
  Top 0.305: U5.2 17.93,38.72 C9.2
FT_RX
  Top 0.305: U5.5 15.98,38.76 R15.2
FT_TX
  Top 0.305: U5.1 18.58,38.26 R2.2
GND  (via drill 0.3, 0.41)
  Top 0.305: U7.7 63.04,46.15 62.36,45.47 59.69,45.47 v59.31,45.21 | U6.52 v56.26,35.3 v56.26,35.31 | 54.23,34.92 54.23,34.76 U6.54 | 27.18,26.61 U1.5 | Y2.2 24.38,31.75 24.26,31.88 v24.26,31.75 | U5.21 14.03,32.31 14.99,33.27 17.65,33.27 v18.16,33.78 | 51.69,44.2 51.05,44.83 48.77,44.83 v47.62,45.97 | C17.2 43.42,8.06 v43.48,8 | U2.1 18.68,24.12 U2.HEAT 19.18,23.12 U2.3 | U10.4 10.86,18.48 v10.92,18.41 | C14.2 C22.1
  Top 0.406: U5.18 12.08,27.42 | C8.1 12.08,27.32 12.08,27.42 | U5.26 17.28,27.68 v17.78,27.56 | U5.7 14.68,37.39 v13.97,38.1 | 24.64,31.5 24.26,31.88 24.13,32 | U6.54 54.23,35.24 v54.23,35.56 | C13.1 19.46,15.47 v19.43,15.49 | 3.81,16.38 v4.45,17.02 | 12.08,27.42 11.68,27.81 v11.05,27.81
  Top 1.27: 36.2,29.59 36.2,31.11 35.31,31.62 35.31,34.8 33.02,37.08 33.02,39.37
  Bottom 0.305: v10.92,18.41 12.57,18.41 13.21,17.78 R24.1
  other vias: 11.81,33.66 9.02,29.59 20.32,37.72 5.71,39.37 5.71,38.61 12.06,40.51 8.38,44.96 6.1,44.2 2.41,38.48 40.26,37.59 38.35,44.07 20.95,28.19 29.97,21.21 29.97,20.45 65.15,20.83 58.42,23.75 58.67,21.97 58.04,30.99 65.15,48.01 65.41,38.61 65.15,48.77 61.72,47.12 40.26,38.48 40.26,36.83 40.77,42.67 40.01,42.67 54.23,34.42 52.2,31.37 63.37,35.31 63.37,34.29 48.13,3.81 38.48,25.91 39.62,25.91 20.95,27.3 31.24,37.21 31.24,36.45 31.24,35.69 29.84,37.08 29.84,36.2 20.32,36.96 23.37,31.75 24.38,32.51 23.37,32.51 28.83,37.08 28.83,36.2 20.95,29.08 18.67,27.56 16.89,27.56 13.08,38.1 12.19,38.1 11.3,38.1 21.34,36.96 22.1,36.96 17.4,33.78 18.29,34.54 17.53,34.54 8.13,29.59 43.31,18.29 43.31,17.53 55.37,19.68 54.48,19.68 55.37,18.8 54.48,18.8 59.69,6.6 57.15,5.97 48.13,3.05 48.13,2.29 47.62,8.26 46.86,8.26 58.04,27.18 57.02,27.18 56.13,27.18 58.04,26.29 57.02,26.29 56.13,26.29 40.51,25.91 41.4,25.91 42.29,25.91 29.97,21.97 60.2,46.99 59.31,44.32 53.21,15.37 4.06,4.32 41.15,22.23 65.79,10.54 66.67,10.54 64.9,10.54 64.9,9.65 65.15,20.07 4.95,4.32 34.29,3.81 53.72,44.7 17.65,47.62 18.54,48.9 13.72,48.9 39.5,4.7 66.04,19.81 67.69,21.08 67.18,8 40.26,22.23 39.37,22.23 43.69,50.8 56.39,42.16 56.13,40.39 56.52,41.27 53.09,44.07 59.69,5.84 57.15,5.08 61.85,6.48 61.85,5.59 61.85,4.83 59.69,5.08 37.59,31.24 37.97,30.73 36.96,30.86 38.1,44.7 59.56,13.34 59.56,12.57 64.9,46.1 64.9,45.34 52.7,31.75 39.5,3.94 25.27,2.16 24.38,2.16 26.04,2.16 16.38,11.68 56.52,9.4 24.77,45.59 28.57,43.56 4.19,13.46 13.21,16.64 8.38,25.15 11.81,27.81
  pour Top (isolate 0.254, rank 6): 0,53.34 68.58,53.34 68.58,0 0,0
  pour Bottom (isolate 0.254, rank 6): 0,53.34 68.58,53.34 68.58,0 0,0
GPS_RF_IN
  Top 0.61: U6.35 L1.2 63.12,15.24 arc90 GPS.D
GSM_RF_IN
  Top 0.61: U6.66 42.26,38.96 GSM.D
LED_RX  (via drill 0.3)
  Top 0.406: U5.23 15.33,30.18 16,30.86 16,31.62 v15.88,31.75
  Bottom 0.406: v15.88,31.75 7.87,31.75 7.24,32.38 RX.-
  other vias: 5.84,32.38
LED_TX  (via drill 0.3)
  Top 0.406: v5.84,30.86 5.97,30.86 TX.- | U5.22 14.68,30.68 v14.86,30.86
  Bottom 0.406: v14.86,30.86 v5.84,30.86
LIPO_BAT  (via drill 0.41, 0.61)
  Top 0.305: U2.5 20.84,22.11 20.7,21.97 v20.7,21.84 20.45,21.59 13.84,21.59 | U2.8 20.84,24.65 v20.95,24.77
  Top 0.406: Q3.2 8.76,14.86 9.65,15.75 11.3,15.75 11.68,16.13 R25.2 11.68,17.14 12.95,18.41 12.95,20.7 13.84,21.59
  Top 0.813: J8.2 50.44,8.27 v48.01,5.84 | v34.92,9.27 v27.43,9.27
  Bottom 0.305: v20.95,24.77 20.95,22.1 v20.7,21.84
  Bottom 0.813: v48.01,5.84 39.5,5.84 36.07,9.27 v34.92,9.27 | v20.7,21.84 20.95,21.59 20.95,15.75 21.72,14.99 23.24,14.99 24.26,13.97 24.26,11.05 26.04,9.27 v27.43,9.27
N$1
  Top 0.305: U2.2 16.51,23.62 R20.2
N$2
  Top 0.305: R13.2 RX.+
N$3
  Top 0.305: R3.2 L.+
N$4
  Top 0.305: STA.+ R5.2
N$5  (via drill 0.3, 0.41)
  Top 0.305: U10.6 U10.7 15.23,19.81 v15.11,19.81 | v19.68,25.27 19.68,30.23 18.41,31.5 17.4,31.5 16.38,32.51 v15.24,32.51
  Bottom 0.305: v15.24,32.51 8.26,32.51 7.37,33.4 2.16,33.4 1.4,32.64 R3.1 | v19.68,25.27 19.68,19.05 17.02,16.38 15.75,16.38 15.49,16.64 15.49,19.43 v15.11,19.81
  other vias: 1.4,29.59
N$6
  Top 0.356: U5.19 12.73,28.04 13.72,27.05
  Top 0.406: U5.17 11.43,30.48 11.81,30.86 12.45,30.86 12.7,30.61 12.7,29.29 U5.19 | C8.2 13.72,27.05
N$7
  Top 0.305: PWR.+ R10.2
N$8
  Top 0.305: R14.2 TX.+
N$9
  Top 0.406: J2.1 10.74,40.56 F2.1
N$10
  Top 0.305: NET.+ R4.2
N$11
  Bottom 0.305: R18.1 51.36,14.22 U8.3
N$12
  Bottom 0.305: R17.1 51.48,16.89 U8.2
N$13
  Top 0.305: U6.19 41.26,12.46 39.75,13.97 30.99,13.97 30.73,14.22 C21.1 29.84,13.34 29.21,12.7 R12.1
N$15  (via drill 0.3)
  Top 0.305: U6.21 43.18,11.16 43.18,9.65 43.5,9.34 C20.2 43.43,8.95 C17.1 C18.1 C16.2 39.94,8.95 39.62,8.64 39.62,7.87 39.27,7.52 37.31,7.52 37.08,7.75 27.56,7.75 v27.3,8 | v18.54,9.91 17.52,9.91 J3.4
  Bottom 0.305: v27.3,8 20.45,8 v18.54,9.91
N$16
  Bottom 0.305: R19.2 51.48,15.62 U8.7
N$17
  Top 0.406: R7.1 R9.2 21.97,32.51 22.99,33.53 U4.1
N$18  (via drill 0.3)
  Top 0.305: D2.+ 44.07,43.69 44.96,42.8 44.96,39.88 47.62,37.21 v58.04,37.21 | U6.16 39.99,16.24 v44.7,20.95
  Bottom 0.305: v44.7,20.95 46.74,20.95 52.32,26.54 52.32,29.97 58.04,35.69 v58.04,37.21
N$19
  Top 0.305: J3.3 24.17,9.87 24.17,9.62 26.8,6.99 40.39,6.99 | U6.22 44.39,11.11 C20.1 C19.2 | C19.2 45.66,8 C15.2 | C19.2 44.39,7.18 44.2,6.99 40.39,6.99 | C16.1 40.39,6.99
N$20
  Top 0.305: U2.7 21.71,23.62 21.72,23.62 22.1,23.24 22.1,20.7 21.59,20.19 CH.-
N$21
  Top 0.305: L1.1 R8.2 C23.2
N$22
  Top 0.305: U2.6 21.46,23.12 21.59,22.99 21.59,21.34 21.21,20.95 18.03,20.95 OK.-
N$23
  Top 0.406: R26.1 17.91,18.29 OK.+
N$24
  Top 0.61: R25.1 8.76,16.64 C2.1
N$25
  Top 0.406: CH.+ 18.92,16.64 18.16,15.88 R21.1
N$27  (via drill 0.61)
  Top 0.406: L2.2 9.63,24.49 C3.1
  Top 0.61: U3.5 1.97,27.12 v2.03,27.18 | v9.02,21.21 9.02,22.37 L2.2
  Bottom 0.61: v2.03,27.18 2.03,21.08 3.05,20.07 7.87,20.07 v9.02,21.21
N$30  (via drill 0.41)
  Top 0.305: C22.2 28.45,13.97 28.32,13.97 27.18,12.83 R12.2
  Top 0.406: J3.1 31.5,4.07 31.51,4.06 v31.75,4.06 | R12.2 27.18,12.06 27.56,11.68 v31.88,11.68
  Bottom 0.406: v31.75,4.06 32.26,4.57 32.26,11.3 v31.88,11.68
N$68
  Top 0.305: Q2.1 23.88,44.07 24.51,43.43 24.51,42.93 24.96,42.48 R22.2 R23.2
NETLIGHT  (via drill 0.3)
  Top 0.305: 60.96,44.83 v60.83,44.83 60.85,44.85 U7.5 | U6.50 v53.99,30.24 v53.98,30.23
  Bottom 0.305: v60.83,44.83 60.83,39.12 58.93,37.21 58.93,35.18 v53.98,30.23
NETLIGHT_5V
  Top 0.305: R4.1 12.95,46.23 17.4,46.23 20.07,48.9 51.94,48.9 55.99,44.85 U7.10
PB0  (via drill 0.3)
  Top 0.305: U1.12 28.18,22.75 v28.19,22.73 | J7.6 47.5,41.53 46.61,42.42 46.61,44.2 45.34,45.47 v43.18,45.47
  Bottom 0.305: v28.19,22.73 28.19,27.18 30.99,29.97 42.42,29.97 43.18,30.73 v43.18,45.47 43.18,49.15 41.66,50.67 J1.1
PB1  (via drill 0.3)
  Top 0.305: U1.13 27.29,21.95 v27.3,21.97
  Bottom 0.305: v27.3,21.97 27.3,27.3 30.61,30.61 35.31,30.61 37.34,32.64 37.34,45.72 | 37.34,45.72 37.34,49.02 J1.2 | J5.2 37.34,45.72
PB2  (via drill 0.3)
  Top 0.305: U1.14 26.61,21.15 v26.67,21.21 | R22.1 25.65,44.32 26.42,45.09 v36.58,45.09
  Bottom 0.305: v26.67,21.21 26.67,27.69 30.23,31.24 34.92,31.24 36.58,32.89 v36.58,45.09 J1.3
PB3/MOSI  (via drill 0.3)
  Top 0.305: U1.15 26,20.35 v26.04,20.32 | ICSP.5 67.56,29.34 67.56,31.24 65.41,33.4 40.01,33.4 39.24,34.16 39.24,42.04 37.21,44.07 v35.81,44.07
  Bottom 0.305: v26.04,20.32 26.04,28.07 29.84,31.88 34.29,31.88 35.81,33.4 v35.81,44.07 35.81,49.02 J1.4
PB4/MISO  (via drill 0.3)
  Top 0.305: U1.16 v25.39,19.55 v25.4,19.56 | v62.61,47.62 60.71,49.53 33.02,49.53 31.75,50.8 J1.5
  Bottom 0.305: v25.4,19.56 25.4,28.32 29.59,32.51 33.91,32.51 34.92,33.53 34.92,47.37 J1.5 | v62.61,47.62 62.61,38.48 60.45,36.32 60.45,32.89 62.87,30.48 ICSP.1
PB5/SCK  (via drill 0.3, 0.41)
  Top 0.305: U1.17 24.77,18.1 v24.77,18.8 24.64,18.67 21.46,18.67 v19.94,17.14 | ICSP.2 64.14,27.94 64.9,28.7 64.9,31.62 63.88,32.64 39.88,32.64 38.61,33.91 38.61,41.78 37.08,43.31 v34.04,43.31 | 14.99,18.8 v14.73,18.8 14.77,18.84 U10.5
  Bottom 0.305: v24.77,18.8 24.77,28.7 29.21,33.15 33.02,33.15 34.04,34.16 v34.04,43.31 34.04,45.72 J1.6 | v14.73,18.8 14.48,18.54 14.48,16.26 14.99,15.75 17.91,15.75 19.3,17.14 v19.94,17.14
PC0  (via drill 0.3)
  Top 0.305: U1.23 29.61,17 29.84,16.76 v34.29,16.76
  Bottom 0.305: v34.29,16.76 37.59,16.76 44.96,9.4 49.28,9.4 50.8,7.87 PC.1
PC1  (via drill 0.3)
  Top 0.305: U1.24 34.27,18.06 v34.29,18.03
  Bottom 0.305: v34.29,18.03 37.34,18.03 45.21,10.16 50.16,10.16 51.56,8.76 51.56,4.32 PC.2
PC2  (via drill 0.3)
  Top 0.305: U1.25 v34.41,19.55 v34.42,19.56
  Bottom 0.305: v34.42,19.56 36.83,19.56 45.47,10.92 53.47,10.92 55.88,8.51 PC.3
PC3  (via drill 0.3)
  Top 0.305: U1.26 33.88,20.35 v33.91,20.32
  Bottom 0.305: v33.91,20.32 37.21,20.32 45.85,11.68 55.75,11.68 58.42,9.02 PC.4
PC4/SDA  (via drill 0.3)
  Top 0.305: U1.27 34.35,21.15 v34.42,21.08 | v57.15,11.43 57.15,22.23 48.13,31.24 39.37,31.24 37.08,33.53 37.08,40.51 35.81,41.78 v32,41.78
  Bottom 0.305: v34.42,21.08 37.34,21.08 46.1,12.32 56.26,12.32 v57.15,11.43 60.96,7.62 PC.5 | J1.9 21.72,50.8 24.64,47.88 29.34,47.88 32,45.21 v32,41.78
PC5/SCL  (via drill 0.3)
  Top 0.305: U1.28 34.02,21.95 v34.04,21.97 | v57.91,11.94 57.91,22.86 48.9,31.88 39.62,31.88 37.85,33.66 37.85,41.15 36.45,42.55 v30.86,42.55
  Bottom 0.305: v34.04,21.97 37.34,21.97 46.35,12.95 56.9,12.95 v57.91,11.94 57.91,11.81 63.5,6.22 PC.6 | J1.10 19.3,50.8 23.11,46.99 28.7,46.99 30.86,44.83 v30.86,42.55
PD0/RX  (via drill 0.3)
  Top 0.305: U1.30 33.85,23.55 v33.91,23.5 | R2.1 19.05,40.51 19.05,44.2 21.84,46.99 50.29,46.99 v52.45,44.83
  Bottom 0.305: PD.1 63.25,50.8 61.34,48.9 59.69,48.9 56.9,46.1 | 56.9,46.1 53.72,46.1 v52.45,44.83 | v33.91,23.5 45.97,23.5 49.66,27.18 49.66,36.32 50.93,37.59 53.59,37.59 J7.3 55.88,38.99 57.28,40.39 57.28,45.72 56.9,46.1
PD1/TX  (via drill 0.3)
  Top 0.305: U1.31 34.26,24.35 v34.29,24.38 | R15.1 v14.99,40.39 | v20.45,46.86 21.21,47.62 50.8,47.62 v52.45,45.97
  Bottom 0.305: PD.2 60.33,50.8 56.39,46.86 53.34,46.86 v52.45,45.97 | v34.29,24.38 45.72,24.38 48.77,27.43 48.77,37.47 48.51,37.72 48.51,40.26 | v14.99,40.39 14.99,41.4 v20.45,46.86 | v52.45,45.97 52.26,45.78 | 48.51,40.26 48.51,42.04 v52.45,45.97 | J7.4 53.72,40.26 48.51,40.26
PD2/INT0  (via drill 0.3)
  Top 0.305: U1.32 v33.78,25.15
  Bottom 0.305: PD.3 55.24,47.62 53.09,47.62 47.88,42.42 47.88,27.69 45.34,25.15 v33.78,25.15
PD3/INT1  (via drill 0.3)
  Top 0.305: U1.1 32.99,26.64 v33.02,26.67
  Bottom 0.305: v33.02,26.67 45.85,26.67 47.24,28.07 47.24,42.8 52.83,48.39 54.74,48.39 55.88,49.53 PD.4
PD4  (via drill 0.3)
  Top 0.305: U1.2 29.61,27.58 29.84,27.81 31.88,27.81 v32.38,27.3
  Bottom 0.305: PD.5 53.34,50.16 46.61,43.43 46.61,28.7 45.21,27.3 v32.38,27.3
PD5  (via drill 0.3)
  Top 0.305: U1.9 23.45,25.02 24.26,25.02 24.38,24.89 29.34,24.89 29.59,25.15 v30.35,25.15
  Bottom 0.305: PD.6 45.85,45.85 45.85,29.34 44.45,27.94 31.88,27.94 30.35,26.42 v30.35,25.15
PD6  (via drill 0.3)
  Top 0.305: U1.10 29.56,24.35 v29.59,24.26
  Bottom 0.305: v29.59,24.26 29.59,26.54 31.62,28.57 43.81,28.57 45.09,29.84 45.09,47.62 PD.7
PD7  (via drill 0.3)
  Top 0.305: U1.11 28.89,23.55 v28.96,23.5 | J7.1 47.12,38.99 45.85,40.26 45.85,43.56 44.96,44.45 v44.07,44.45
  Bottom 0.305: v28.96,23.5 28.96,26.92 31.24,29.21 43.05,29.21 44.07,30.23 v44.07,44.45 44.07,49.15 PD.8
PWRKEY  (via drill 0.3)
  Top 0.305: v4.06,44.96 2.22,44.96 KEY.2 | U6.8 52.44,24.24 52.96,24.77 52.96,25.4 47.88,30.48 39.24,30.48 36.45,33.27 36.45,39.88 35.31,41.02 v24.77,41.02 24.77,41.53 24.26,42.04 Q2.3
  Bottom 0.305: v24.77,41.02 17.02,41.02 15.24,39.24 7.75,39.24 4.95,42.04 4.95,44.07 v4.06,44.96
RESET  (via drill 0.3)
  Top 0.305: ICSP.3 63.63,23.62 67.82,19.43 v67.82,18.67 | POWER.6 33.02,2.16 34.16,1.02 64.39,1.02 65.15,1.78 v65.15,3.68 | U1.29 33.13,22.75 v33.15,22.73 | C9.1 R11.2 17.14,41.78 14.99,43.94 7.62,43.94 6.99,44.58 6.99,48.77 8.76,50.55 RST.P$2
  Bottom 0.254: 33.15,2.67 33.15,10.29 34.29,11.43 34.29,13.34 33.53,14.1 33.15,14.1
  Bottom 0.305: v33.15,22.73 33.15,14.1 25.53,14.1 22.1,17.53 22.1,28.45 28.32,34.67 31.62,34.67 32.64,35.69 32.64,39.12 31.75,40.01 24.38,40.01 24,40.39 C9.1 | 33.15,2.67 POWER.6 | v65.15,3.68 64.26,4.57 64.26,6.73 67.82,10.29 v67.82,18.67
  other vias: 17.78,40.39
RST
  Top 0.305: D2.- 39.62,43.69 J5.1
RXD  (via drill 0.3)
  Top 0.305: 60.33,43.56 v60.2,43.56 60.21,43.55 U7.3 | U6.15 39.59,17.24 v44.07,21.72
  Bottom 0.305: v44.07,21.72 46.35,21.72 51.44,26.8 51.44,34.29 53.34,36.2 55.5,36.2 60.2,40.89 v60.2,43.56
RXD_5V
  Top 0.305: U7.12 54.47,43.55 J7.5
SIM_CLK  (via drill 0.3)
  Top 0.305: U6.31 53.26,13.41 52.45,14.22 v46.1,14.22
  Bottom 0.305: v46.1,14.22 R18.2
SIM_DATA  (via drill 0.3)
  Top 0.305: U6.30 52.26,12.51 51.44,13.34 45.97,13.34 45.09,14.22 45.09,14.86 45.85,15.62 v45.97,15.62
  Bottom 0.305: v45.97,15.62 R19.1
SIM_RST  (via drill 0.3)
  Top 0.305: U6.32 54.26,16.1 53.47,16.89 v45.97,16.89
  Bottom 0.305: v45.97,16.89 R17.2
SIM_VDD  (via drill 0.3)
  Top 0.305: v46.35,19.43 45.09,19.43 44.32,18.67 44.32,13.97 45.59,12.7 50.93,12.7 51.26,12.37 U6.29
  Bottom 0.305: U8.1 48.55,19.47 C24.1 v46.35,19.43
STATUS  (via drill 0.3)
  Top 0.305: v61.72,44.2 U7.4 | U6.49 54.58,29.24 v54.48,29.34
  Bottom 0.305: v54.48,29.34 59.56,34.42 59.56,36.58 61.72,38.73 v61.72,44.2
STATUS_5V
  Top 0.305: 12.95,44.83 R5.1 17.27,44.96 20.57,48.26 51.31,48.26 55.37,44.2 U7.11
TXD  (via drill 0.3)
  Top 0.305: 59.56,42.93 v59.44,42.93 59.47,42.9 U7.2 | U6.14 38.94,18.24 v43.18,22.48
  Bottom 0.305: v43.18,22.48 46.1,22.48 50.55,26.92 50.55,35.94 51.56,36.96 54.99,36.96 59.44,41.4 v59.44,42.93
TXD_5V
  Top 0.305: U7.13 54.58,42.9 53.72,42.04 53.72,40.26 J7.2
VDD_EXT  (via drill 0.3)
  Top 0.305: U7.8 62.15,46.15 62.87,46.86 65.15,46.86 65.53,46.48 65.53,43.05 64.72,42.25 64.39,42.25 | 64.39,42.25 U7.1 63.93,42.25 | v64.26,41.66 64.26,42.12 64.39,42.25 | U6.7 51.59,25.24 v52.07,25.25
  Top 0.406: v62.48,21.59 R8.1
  Bottom 0.305: v64.26,41.66 64.26,37.85 61.85,35.43 61.85,33.91 63.37,32.38 66.67,32.38 67.82,31.24 67.82,25.15 66.8,24.13 62.48,24.13 | 62.48,24.13 v62.48,21.59 | 62.48,24.13 61.59,24.13 60.48,25.25 v52.07,25.25
VIN  (via drill 0.41, 0.61, 0.81)  (1 unrouted)
  Top 0.305: v16.13,22.61 18.01,22.61
  Top 0.406: Q3.1 9.14,13.08 9.65,13.59 9.65,14.22 10.29,14.86 13.08,14.86 14.73,16.51 R24.2 15.37,17.27 R26.2
  Top 0.61: R26.2 R21.2 | 6.35,8.89 6.35,3.3 7.37,2.29 J6.+ | C1.+ 6.35,8.89 | U3.4 U3.3 6.02,23.85 L2.1 v6.73,22.99 | C27.1 6.22,14.48 | 6.22,14.48 Q3.3 | 6.35,8.89 6.35,12.95 | 6.35,12.95 6.35,14.35 6.22,14.48 | Q3.1 6.48,13.08 6.35,12.95
  Bottom 0.305: R26.2 16.38,22.35 v16.13,22.61
  Bottom 0.61: 13.59,26.54 10.54,26.54 9.78,25.78 9.78,23.88 9.91,23.75 | 9.91,23.75 11.05,22.61 v16.13,22.61 | v6.73,22.99 9.14,22.99 9.91,23.75
  Bottom 0.813: v26.67,36.58 23.62,36.58 13.59,26.54
  other vias: 16.38,17.27
VRTC  (via drill 0.41)
  Top 0.406: C7.2 U6.17 v36.58,15.24
  Bottom 0.406: J14.+ 37.28,14.53 v36.58,15.24
XTAL1
  Top 0.305: U1.7 25.61,28.24 R6.2 25.38,28.46 Y2.1
XTAL2
  Top 0.305: Y2.3 23.38,28.94 R6.1 24.81,27.51 U1.8

### Text on the board
tPlace: 1 | 1 | 1 | 1 | 9 | 8 | 7 | 6 | 5 | 4 | 3 | 2 | 1 | 0 | SCL | SDA | GND | 3 | 2 | 1 | 0 | RST | AREF | SIM_RX | SWserial | HWserial | SIM_TX | VCC | GND | - | + | IOREF | RST | 3V3 | 5V | GND | Vin | 0 | 1 | 2 | 3 | 4 | 5
bPlace: PIN | FUNCTION | RXD/PCINT16 | 0 | 1 | INT0 | TXD/PCINT17 | 2 | INT1/0C2B | 3 | PD[0:7] | XCK/T0 | 4 | 5 | 0C0B/T1 | 0C0A/AIN0 | 6 | AIN1 | 7 | ICP1 | 8 | Elecrow SIMduino | OC1A | 9 | SS/0C1B | 10 | PB[0:5] | MOSI/OC2A | 11 | UNO+SIM808 v2.2 | MISO | 12 | www.elecrow.com | SCK | 13 | ADC0 | 14 | ADC1 | 15 | ADC2 | 16 | ADC3 | PC[0:5] | 17 | ADC4/SDA | 18 | ADC5/SCL | 19